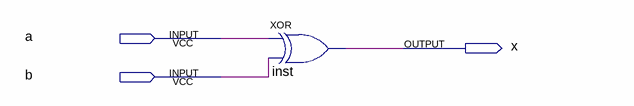
[diagram p0: schematic sheet]
// Quartus schematic Questao1.bdf as structural Verilog: 1 symbols, 3 pins
module Questao1 (
  input  a,
  input  b,
  output x
);

  xor inst (x, a, b);
endmodule
